# Altium schematic sheet COMMINACATION.SchDoc
size A4 portrait; Address1: 00-<Schema Name>; DocumentNumber: 5; SheetNumber: 5; SheetTotal: 5; ModifiedBy: -; RevisionDate: -; Size: A3
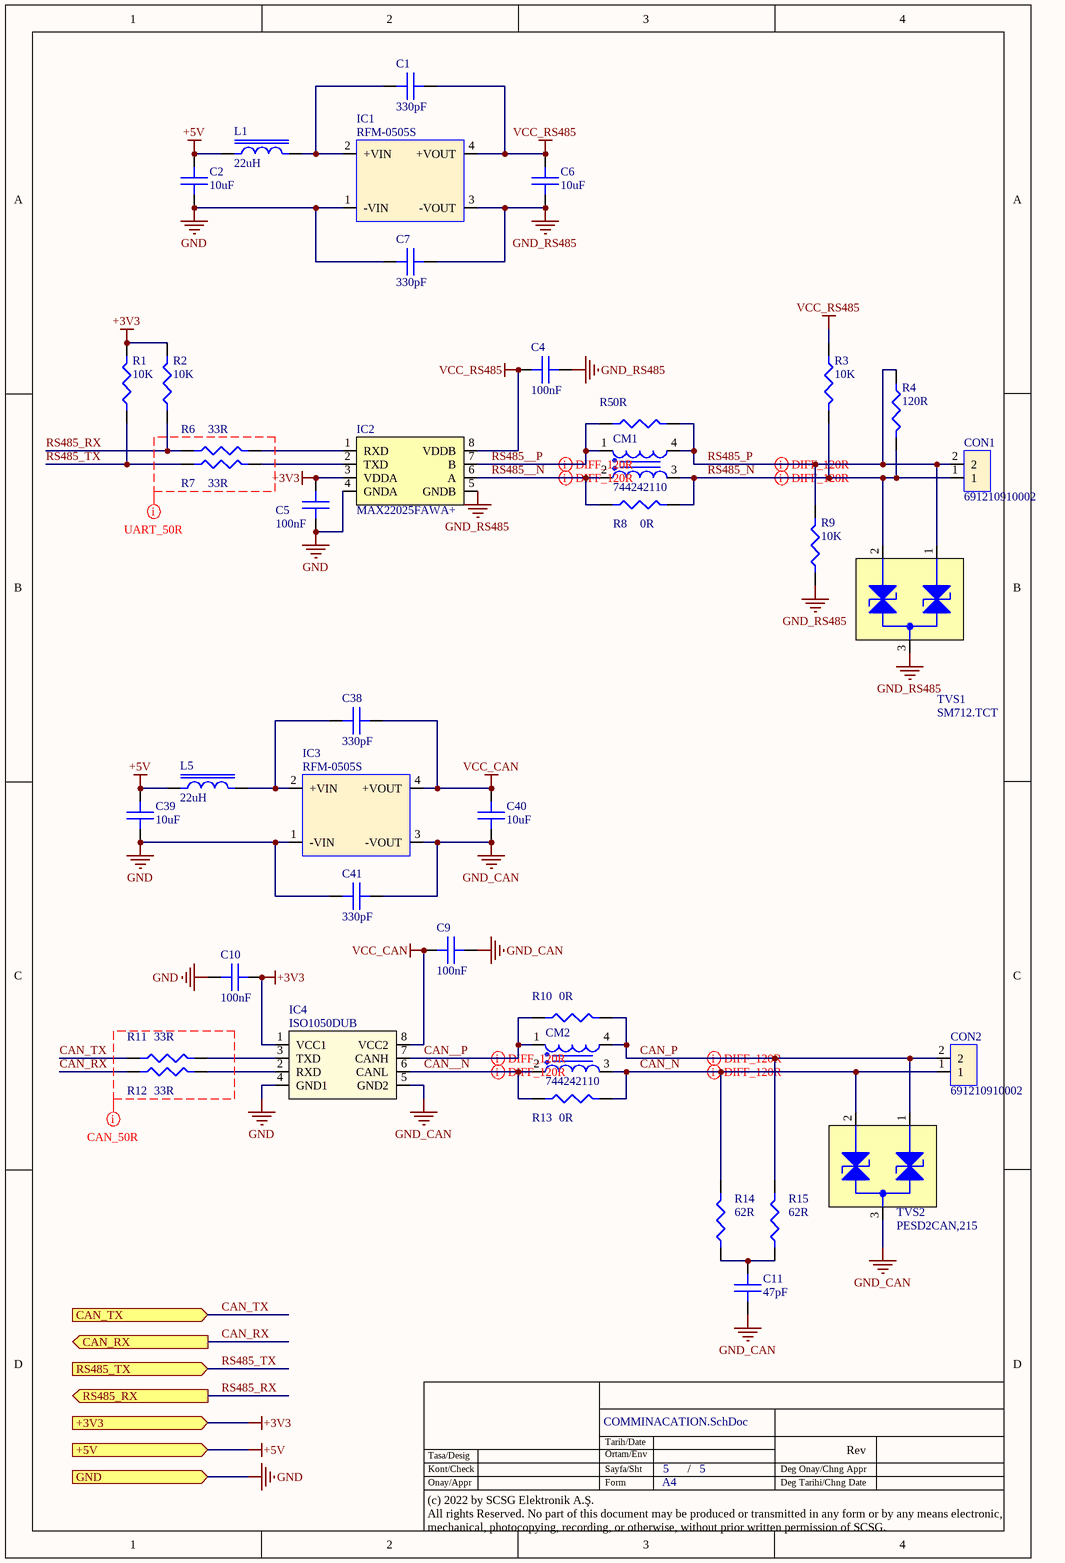
[diagram p0: COMMINACATION.SchDoc]

## Parts
C1  330pF  [C1206]
C2  10uF  [C0402]
C4  100nF  [C0402]
C5  100nF  [C0402]
C6  10uF  [C0402]
C7  330pF  [C1206]
C9  100nF  [C0402]
C10  100nF  [C0402]
C11  47pF  [C0402]
C38  330pF  [C1206]
C39  10uF  [C0402]
C40  10uF  [C0402]
C41  330pF  [C1206]
CM1  744242110  [WE-SLM_L6W3.3H3.3]
CM2  744242110  [WE-SLM_L6W3.3H3.3]
CON1  691210910002  [691210910002]
CON2  691210910002  [691210910002]
IC1  RFM-0505S  [RFM-0505S]
IC2  MAX22025FAWA+  [WIDE SOIC 08]
IC3  RFM-0505S  [RFM-0505S]
IC4  ISO1050DUB  [SOP254P1040X485-8N]
L1  22uH  [WE-LQ_1210]
L5  22uH  [WE-LQ_1210]
R1  10K  [R0402]
R2  10K  [R0402]
R3  10K  [R0402]
R4  120R  [R0603]
R5  0R  [R0402]
R6  33R  [R0402]
R7  33R  [R0402]
R8  0R  [R0402]
R9  10K  [R0402]
R10  0R  [R0402]
R11  33R  [R0402]
R12  33R  [R0402]
R13  0R  [R0402]
R14  62R  [R0805]
R15  62R  [R0805]
TVS1  SM712.TCT  [WE-TVS_SOT23-3L]
TVS2  PESD2CAN,215  [WE-TVS_SOT23-3L]

## Ports
+3V3 (in), +5V (in), CAN_RX (out), CAN_TX (in), GND (in), RS485_RX (out), RS485_TX (in)

## Nets
+3V3: C5.2 C10.2 IC2.3(VDDA) IC4.1(VCC1) R1.2 R2.2 ; port +3V3
+5V: C2.2 C39.2 L1.1 L5.1 ; port +5V
GND: C2.1 C5.1 C7.1 C10.1 C39.1 C41.1 IC1.1(-VIN) IC2.4(GNDA) IC3.1(-VIN) IC4.4(GND1) ; port GND
GND_CAN: C9.1 C11.1 C40.1 C41.2 IC3.3(-VOUT) IC4.5(GND2) TVS2.3(GND)
GND_RS485: C4.1 C6.1 C7.2 IC1.3(-VOUT) IC2.5(GNDB) R9.1 TVS1.3(GND)
VCC_CAN: C9.2 C38.2 C40.2 IC3.4(+VOUT) IC4.8(VCC2)
VCC_RS485: C1.2 C4.2 C6.2 IC1.4(+VOUT) IC2.8(VDDB) R3.1
CAN__N: CM2.2 IC4.6(CANL) R13.1
CAN__P: CM2.1 IC4.7(CANH) R10.1
CAN_N: CM2.3 CON2.1 R13.2 R14.2 TVS2.2(I/O_2)
CAN_P: CM2.4 CON2.2 R10.2 R15.2 TVS2.1(I/O_1)
CAN_RX: R12.1 ; port CAN_RX
CAN_TX: R11.1 ; port CAN_TX
RS485__N: CM1.2 IC2.6(A) R8.1
RS485__P: CM1.1 IC2.7(B) R5.1
RS485_N: CM1.3 CON1.1 R3.2 R4.2 R8.2 TVS1.2(I/O_2)
RS485_P: CM1.4 CON1.2 R4.1 R5.2 R9.2 TVS1.1(I/O_1)
RS485_RX: R2.1 R6.1 ; port RS485_RX
RS485_TX: R1.1 R7.1 ; port RS485_TX
NetC1_1: C1.1 IC1.2(+VIN) L1.2
NetC11_2: C11.2 R14.1 R15.1
NetC38_1: C38.1 IC3.2(+VIN) L5.2
NetIC2_1: IC2.1(RXD) R6.2
NetIC2_2: IC2.2(TXD) R7.2
NetIC4_2: IC4.2(RXD) R12.2
NetIC4_3: IC4.3(TXD) R11.2

## Layout directives
differential pair; differential pair class RS485_120R: RS485__N, RS485__P, RS485_N, RS485_P
differential pair; differential pair class CAN_120R: CAN__N, CAN__P, CAN_N, CAN_P
net class UART_50R: (no net found under the mark)
net class CAN_50R: (no net found under the mark)

## Notes on the sheet
- Tarih/Date
- Tasa/Desig
- Kont/Check
- Onay/Appr
- Sayfa/Sht
- Form
- Ortam/Env
- A4
- /
- Deg Tarihi/Chng Date
- Deg Onay/Chng Appr
- Rev
- (c) 2022 by SCSG Elektronik A.Ş.
  All rights Reserved. No part of this document may be produced or transmitted in any form or by any means electronic, mechanical, photocopying, recording, or otherwise, without prior written permission of SCSG.

## Library data of the parts
C1 C7 = CC1206JKNPOCBN331: 330pF, 1000V,  C0G, 1206; Manufacturer: Yageo; Temperature Coefficient: 30ppm/°C; Dielectric Material: Ceramic; Purpose Of Usage: RS485; Tolerance: 5%; Value: 330000; Manufacturer Part Number: CC1206JKNPOCBN331; RoHS: YES; Category: CAPASITOR; Case/Package: 1206; Case Code (Imperial): 0805; Case Code (Metric): 3216; Dielectric: C0G; Height: 1.15mm; Local Supplier: GENERAL; Max Operating Temperature: 125°C; Min Operating Temperature: -55°C; Mount: SMD; Price 10K: 0.00250; Stock ID: ??; Sub-Category: CERAMIC; Supplier 1: Digi-Key; Supplier Part Number 1: 311-3626-1-ND; Voltage Rating (DC): 1000V; Voltage Rating: 1000V
C2 C6 = GRM155R60J106ME15D: 10uF, 6.3V, X5R, 0402; Manufacturer: Murata; Value: 10000000; Tolerance: 20%; Dielectric Material: Ceramic; Purpose Of Usage: RS485; Supplier 1: Digi-Key; Manufacturer Part Number: GRM155R60J106ME15D; RoHS: YES; Category: CAPASITOR; Mount: SMD; Case/Package: 0402; Case Code (Metric): 1005; Case Code (Imperial): 0402; Min Operating Temperature: -55°C; Max Operating Temperature: 85°C; Voltage Rating: 6.3V; Voltage Rating (DC): 6.3V; Dielectric: X5R; Supplier Part Number 1: 490-13238-1-ND; Sub-Category: CERAMIC; Stock ID: ??; Local Supplier: GENERAL; Price 10K: 0.00250
C4 C5 = CC0402KRX7R6BB104: 100nF ,10V ,X7R ,0402; Manufacturer: Yageo; Value: 100000; Tolerance: 10%; Dielectric Material: Ceramic; Purpose Of Usage: RS485; Supplier 1: Digi-Key; Manufacturer Part Number: CC0402KRX7R6BB104; RoHS: YES; Category: CAPASITOR; Mount: SMD; Case/Package: 0402; Case Code (Imperial): 0402; Case Code (Metric): 1005; Min Operating Temperature: -55°C; Max Operating Temperature: 125°C; Voltage Rating: 10V; Voltage Rating (DC): 10V; Dielectric: X7R; Height: 0.5mm; Supplier Part Number 1: 311-1345-1-ND; Sub-Category: CERAMIC; Stock ID: ??; Local Supplier: GENERAL; Price 10K: 0.00250
C9 C10 = CC0402KRX7R6BB104: 100nF ,10V ,X7R ,0402; Manufacturer: Yageo; Value: 100000; Tolerance: 10%; Dielectric Material: Ceramic; Purpose Of Usage: CAN; Supplier 1: Digi-Key; Manufacturer Part Number: CC0402KRX7R6BB104; RoHS: YES; Category: CAPASITOR; Mount: SMD; Case/Package: 0402; Case Code (Imperial): 0402; Case Code (Metric): 1005; Min Operating Temperature: -55°C; Max Operating Temperature: 125°C; Voltage Rating: 10V; Voltage Rating (DC): 10V; Dielectric: X7R; Height: 0.5mm; Supplier Part Number 1: 311-1345-1-ND; Sub-Category: CERAMIC; Stock ID: ??; Local Supplier: GENERAL; Price 10K: 0.00250
C11 = CC0402JRNPO9BN470: 47pF, 50V, NP0, 0402; Manufacturer: Yageo; Dielectric Material: Ceramic; Value: 47; Tolerance: 5%; Dielectric: C0G; Purpose Of Usage: CAN; Supplier 1: Digi-Key; Manufacturer Part Number: CC0402JRNPO9BN470; RoHS: YES; Category: CAPASITOR; Case/Package: 0402; Case Code (Metric): 1005; Case Code (Imperial): 0402; Min Operating Temperature: -55°C; Max Operating Temperature: 125°C; Voltage Rating: 50V; Voltage Rating (DC): 50V; Height: 0.5mm; Supplier Part Number 1: 311-1021-2-ND; Mount: SMD; Sub-Category: CERAMIC; Local Supplier: GENERAL; Price 10K: 0.00250; Stock ID: ??
C38 C41 = CC1206JKNPOCBN331: 330pF, 1000V,  C0G, 1206; Manufacturer: Yageo; Temperature Coefficient: 30ppm/°C; Dielectric Material: Ceramic; Purpose Of Usage: CAN; Tolerance: 5%; Value: 330000; Manufacturer Part Number: CC1206JKNPOCBN331; RoHS: YES; Category: CAPASITOR; Case/Package: 1206; Case Code (Imperial): 0805; Case Code (Metric): 3216; Dielectric: C0G; Height: 1.15mm; Local Supplier: GENERAL; Max Operating Temperature: 125°C; Min Operating Temperature: -55°C; Mount: SMD; Price 10K: 0.00250; Stock ID: ??; Sub-Category: CERAMIC; Supplier 1: Digi-Key; Supplier Part Number 1: 311-3626-1-ND; Voltage Rating (DC): 1000V; Voltage Rating: 1000V
C39 C40 = GRM155R60J106ME15D: 10uF, 6.3V, X5R, 0402; Manufacturer: Murata; Value: 10000000; Tolerance: 20%; Dielectric Material: Ceramic; Purpose Of Usage: CAN; Supplier 1: Digi-Key; Manufacturer Part Number: GRM155R60J106ME15D; RoHS: YES; Category: CAPASITOR; Mount: SMD; Case/Package: 0402; Case Code (Metric): 1005; Case Code (Imperial): 0402; Min Operating Temperature: -55°C; Max Operating Temperature: 85°C; Voltage Rating: 6.3V; Voltage Rating (DC): 6.3V; Dielectric: X5R; Supplier Part Number 1: 490-13238-1-ND; Sub-Category: CERAMIC; Stock ID: ??; Local Supplier: GENERAL; Price 10K: 0.00250
CM1 = 744242110: Data Line Filter, 2 Function(s), 80V, 0.3A, 4 Pin(s); Manufacturer: Wurth Electronics; Purpose Of Usage: RS485; Manufacturer Part Number: 744242110; RoHS: Yes; Category: PROTECTION; Local Supplier: Wurth Electronics; Mount: SMD; Stock ID: ??; Sub-Category: FILTER-COMMON MODE; Supplier 1: Digikey; Supplier Part Number 1: 732-1681-1-ND
CM2 = 744242110: Data Line Filter, 2 Function(s), 80V, 0.3A, 4 Pin(s); Manufacturer: Wurth Electronics; Purpose Of Usage: CAN; Manufacturer Part Number: 744242110; RoHS: Yes; Category: PROTECTION; Local Supplier: Wurth Electronics; Mount: SMD; Stock ID: ??; Sub-Category: FILTER-COMMON MODE; Supplier 1: Digikey; Supplier Part Number 1: 732-1681-1-ND
CON1 = 691210910002: 2.54 Mm Terminal Block, Horizont; Manufacturer: Wurth Electronics; Purpose Of Usage: RS485; Supplier 1: Digi-Key; Supplier Part Number 1: 732-691210910002-ND; Manufacturer Part Number: 691210910002; RoHS: No; Category: CONNECTORS; Sub-Category: TERMINAL BLOCK; Stock ID: ??
CON2 = 691210910002: 2.54 Mm Terminal Block, Horizont; Manufacturer: Wurth Electronics; Purpose Of Usage: CAN; Supplier 1: Digi-Key; Supplier Part Number 1: 732-691210910002-ND; Manufacturer Part Number: 691210910002; RoHS: No; Category: CONNECTORS; Sub-Category: TERMINAL BLOCK; Stock ID: ??
IC1 = RFM-0505S: RECOM POWER - RFM-0505S - Isolated Board Mount DC/DC Converter, ITE & General, 1 Output, 1 W, 5 V, 200 mA; Purpose Of Usage: RS485; Supplier 1: Digi-Key; Manufacturer: Recom; Manufacturer Part Number: RFM-0505S; RoHS: No; Supplier Part Number 1: 945-3159-ND; Category: MODULE; Mount: SMD; Stock ID: ??; Sub-Category: DC-DC CONVERTERS
IC2 = MAX22025FAWA+: IC Transceiver Half 1/1 8SOIC; Manufacturer: Analog Devices; Purpose Of Usage: RS485; Manufacturer Part Number: MAX22025FAWA+; RoHS: No; Category: INTEGRATED CIRCUITS; Case/Package: WIDE SOIC; Lead Free: Lead Free; Max Operating Temperature: 85°C; Min Operating Temperature: -40°C; Mount: SMD; Stock ID: ??; Sub-Category: RS485 DRIVER; Supplier 1: Digi-Key; Supplier Part Number 1: 505-MAX22025FAWA+-ND
IC3 = RFM-0505S: RECOM POWER - RFM-0505S - Isolated Board Mount DC/DC Converter, ITE & General, 1 Output, 1 W, 5 V, 200 mA; Purpose Of Usage: CAN; Supplier 1: Digi-Key; Manufacturer: Recom; Manufacturer Part Number: RFM-0505S; RoHS: No; Supplier Part Number 1: 945-3159-ND; Category: MODULE; Mount: SMD; Stock ID: ??; Sub-Category: DC-DC CONVERTERS
IC4 = ISO1050DUB: EAR99 ISO1050 Tube CANbus interface transceiver 5V 73mA 850.995985mg 74ns; Manufacturer: Texas Instruments; Max Supply Voltage: 5.5V; Min Supply Voltage: 3V; Purpose Of Usage: CAN; Manufacturer Part Number: ISO1050DUB; RoHS: Yes; Category: INTEGRATED CIRCUITS; Case/Package: SOP; Min Operating Temperature: -55°C; Max Operating Temperature: 105°C; Package Quantity: 50; Lead Free: Lead Free; Mount: SMD; Stock ID: ??; Sub-Category: CAN DRIVER; Supplier 1: Digi-Key; Supplier Part Number 1: 296-33295-5-ND
L1 = 744032220: General Purpose Inductor, 22uH, 10%, 1 Element, Ferrite-Core, SMD, 1210; Manufacturer: Wurth Electronics; Purpose Of Usage: RS485; Manufacturer Part Number: 744032220; RoHS: YES; Category: INDUCTORS; Case/Package: 1210; Local Supplier: Würth; Max Operating Temperature: 125°C; Min Operating Temperature: -40°C; Mount: SMD; Price 10K: 0.18; Stock ID: ??; Sub-Category: FIXED INDUCTORS; Supplier 1: Digi-Key; Supplier Part Number 1: 732-3058-1-ND; Value: 22uH
L5 = 744032220: General Purpose Inductor, 22uH, 10%, 1 Element, Ferrite-Core, SMD, 1210; Manufacturer: Wurth Electronics; Purpose Of Usage: CAN; Manufacturer Part Number: 744032220; RoHS: YES; Category: INDUCTORS; Case/Package: 1210; Local Supplier: Würth; Max Operating Temperature: 125°C; Min Operating Temperature: -40°C; Mount: SMD; Price 10K: 0.18; Stock ID: ??; Sub-Category: FIXED INDUCTORS; Supplier 1: Digi-Key; Supplier Part Number 1: 732-3058-1-ND; Value: 22uH
R1-R3 R9 = RC0402FR-0710KL: 10K, %1, 1/16W, 0402; Manufacturer: YAGEO; Voltage Rating: 50V; Value: 10000; Power Rating: 63mW; Tolerance: 1%; Temperature Coefficient: 100ppm/°C; Purpose Of Usage: RS485; Supplier 1: Digi-Key; Manufacturer Part Number: RC0402FR-0710KL; RoHS: YES; Category: RESISTOR; Case/Package: 0402; Case Code (Imperial): 0402; Min Operating Temperature: -55°C; Max Operating Temperature: 155°C; Max Power Dissipation: 63mW; Voltage Rating (DC): 50V; Working Voltage: 50V; Supplier Part Number 1: 311-10.0KLRCT-ND; Stock ID: ??; Mount: SMD; Sub-Category: CHIP RESISTOR; Price 10K: 0.0025; Local Supplier: GENERAL
R4 = RC0603FR-07120RL: 120R ,%1 ,1/10 W ,0603; Manufacturer: YAGEO; Value: 120; Tolerance: 1%; Voltage Rating (DC): 50V; Temperature Coefficient: 100ppm/°C; Power Rating: 100mW; Purpose Of Usage: RS485; Supplier 1: Digi-Key; Supplier Part Number 1: 311-120HRCT-ND; Manufacturer Part Number: RC0603FR-07120RL; RoHS: YES; Case/Package: 0603; Case Code (Imperial): 0603; Min Operating Temperature: -55°C; Max Operating Temperature: 155°C; Voltage Rating: 50V; Max Power Dissipation: 100mW; Category: RESISTOR; Sub-Category: CHIP RESISTOR; Stock ID: ??; Mount: SMD; Price 10K: 0.0025; Local Supplier: GENERAL
R5 R8 = RC0402FR-070RL: 0R, %1, 1/10W,  0402; Manufacturer: YAGEO; Value: 0; Tolerance: 1%; Power Rating: 63mW; Voltage Rating: 50V; Temperature Coefficient: 200ppm/°C; Purpose Of Usage: RS485; Supplier 1: Digi-Key; Manufacturer Part Number: RC0402FR-070RL; RoHS: YES; Mount: SMD; Case/Package: 0402; Case Code (Imperial): 0402; Min Operating Temperature: -55°C; Max Operating Temperature: 155°C; Max Power Dissipation: 63mW; Category: RESISTOR; Supplier Part Number 1: 311-0.0LRCT-ND; Sub-Category: CHIP RESISTOR; Stock ID: ??; Price 10K: 0.0025; Local Supplier: GENERAL
R6 R7 = RC0402JR-0733RL: 33R, %5, 1/16W ,0402; Manufacturer: YAGEO; Value: 33; Tolerance: 5%; Power Rating: 63mW; Voltage Rating: 50V; Temperature Coefficient: 100ppm/°C; Purpose Of Usage: RS485; Supplier 1: Digi-Key; Manufacturer Part Number: RC0402JR-0733RL; RoHS: YES; Category: RESISTOR; Case/Package: 0402; Case Code (Imperial): 0402; Min Operating Temperature: -55°C; Max Operating Temperature: 155°C; Max Power Dissipation: 63mW; Supplier Part Number 1: 311-33JRCT-ND; Stock ID: ??; Mount: SMD; Sub-Category: CHIP RESISTOR; Price 10K: 0.0025; Local Supplier: GENERAL
R10 R13 = RC0402FR-070RL: 0R, %1, 1/10W,  0402; Manufacturer: YAGEO; Value: 0; Tolerance: 1%; Power Rating: 63mW; Voltage Rating: 50V; Temperature Coefficient: 200ppm/°C; Purpose Of Usage: CAN; Supplier 1: Digi-Key; Manufacturer Part Number: RC0402FR-070RL; RoHS: YES; Mount: SMD; Case/Package: 0402; Case Code (Imperial): 0402; Min Operating Temperature: -55°C; Max Operating Temperature: 155°C; Max Power Dissipation: 63mW; Category: RESISTOR; Supplier Part Number 1: 311-0.0LRCT-ND; Sub-Category: CHIP RESISTOR; Stock ID: ??; Price 10K: 0.0025; Local Supplier: GENERAL
R11 R12 = RC0402JR-0733RL: 33R, %5, 1/16W ,0402; Manufacturer: YAGEO; Value: 33; Tolerance: 5%; Power Rating: 63mW; Voltage Rating: 50V; Temperature Coefficient: 100ppm/°C; Purpose Of Usage: CAN; Supplier 1: Digi-Key; Manufacturer Part Number: RC0402JR-0733RL; RoHS: YES; Category: RESISTOR; Case/Package: 0402; Case Code (Imperial): 0402; Min Operating Temperature: -55°C; Max Operating Temperature: 155°C; Max Power Dissipation: 63mW; Supplier Part Number 1: 311-33JRCT-ND; Stock ID: ??; Mount: SMD; Sub-Category: CHIP RESISTOR; Price 10K: 0.0025; Local Supplier: GENERAL
R14 R15 = RC0805JR-0762RL: 62R, %5, 1/8W, 0805; Manufacturer: YAGEO; Max Power Dissipation: 125mW; Purpose Of Usage: CAN; Temperature Coefficient: 100ppm/°C; Tolerance: 5%; Value: 62; Voltage Rating: 150V; Manufacturer Part Number: RC0805JR-0762RL; RoHS: YES; Category: RESISTOR; Case/Package: 0805; Case Code (Imperial): 0805; Local Supplier: GENERAL; Max Operating Temperature: 155°C; Min Operating Temperature: -55°C; Mount: SMD; Power Rating: 125mW; Price 10K: 0.0025; Stock ID: ??; Sub-Category: CHIP RESISTOR; Supplier 1: Digi-Key; Supplier Part Number 1: 311-62ARCT-ND
TVS1 = SM712.TCT: SM Series 12 V 400 W Asymmetrical TVS Diode for Extended Common-Mode - SOT-23; Manufacturer: Semtech; Direction: Bidirectional; Number of Elements: 2; Min Breakdown Voltage: 7.5V; Clamping Voltage: 26V; Peak Pulse Power: 400W; Leakage Current: 1uA; Peak Pulse Current: 17A; Working Voltage: 12V; Max Breakdown Voltage: 13.3V; ESD Protection: Yes; Max Reverse Leakage Current: 20uA; Number of Channels: 2NUMBER; Purpose Of Usage: RS485; Manufacturer Part Number: SM712.TCT; RoHS: Yes; Category: PROTECTION; Mounting Technology: Surface Mount; Case/Package: SOT-23; Pins: 3; Min Operating Temperature: -55°C; Max Operating Temperature: 125°C; Number of Bidirectional Channels: 2; Power Dissipation: 400W; Polarity: Bidirectional; Max Power Dissipation: 400W; Breakdown Voltage: 13.3V; Voltage Rating (DC): 12V; Clamping Voltage-Max: 12V; Length: 2.9mm; Lead Free: Lead Free; Local Supplier: GENERAL; Mount: SMD; Power Rating: 400W; Price 10K: 0.5; Stock ID: ??; Sub-Category: TVS - BI DIRECTIONAL; Supplier 1: Digikey; Supplier Part Number 1: SM712CT-ND
TVS2 = PESD2CAN,215: PESD Series 2 Channel Bi-Directional CAN Bus ESD Protection Diode - SOT-23; Manufacturer: Nexperia USA; Manufacturer Part Number: PESD2CAN,215; RoHS: No; Category: PROTECTION; Case/Package: SOT-23; Local Supplier: GENERAL; Mount: SMD; Stock ID: ??; Sub-Category: TVS - BI DIRECTIONAL; Supplier Part Number 1: 1727-3891-2-ND; Purpose Of Usage: CAN; Supplier 1: Digikey